# Altium project Smartwatch CPU Board.PrjPcb
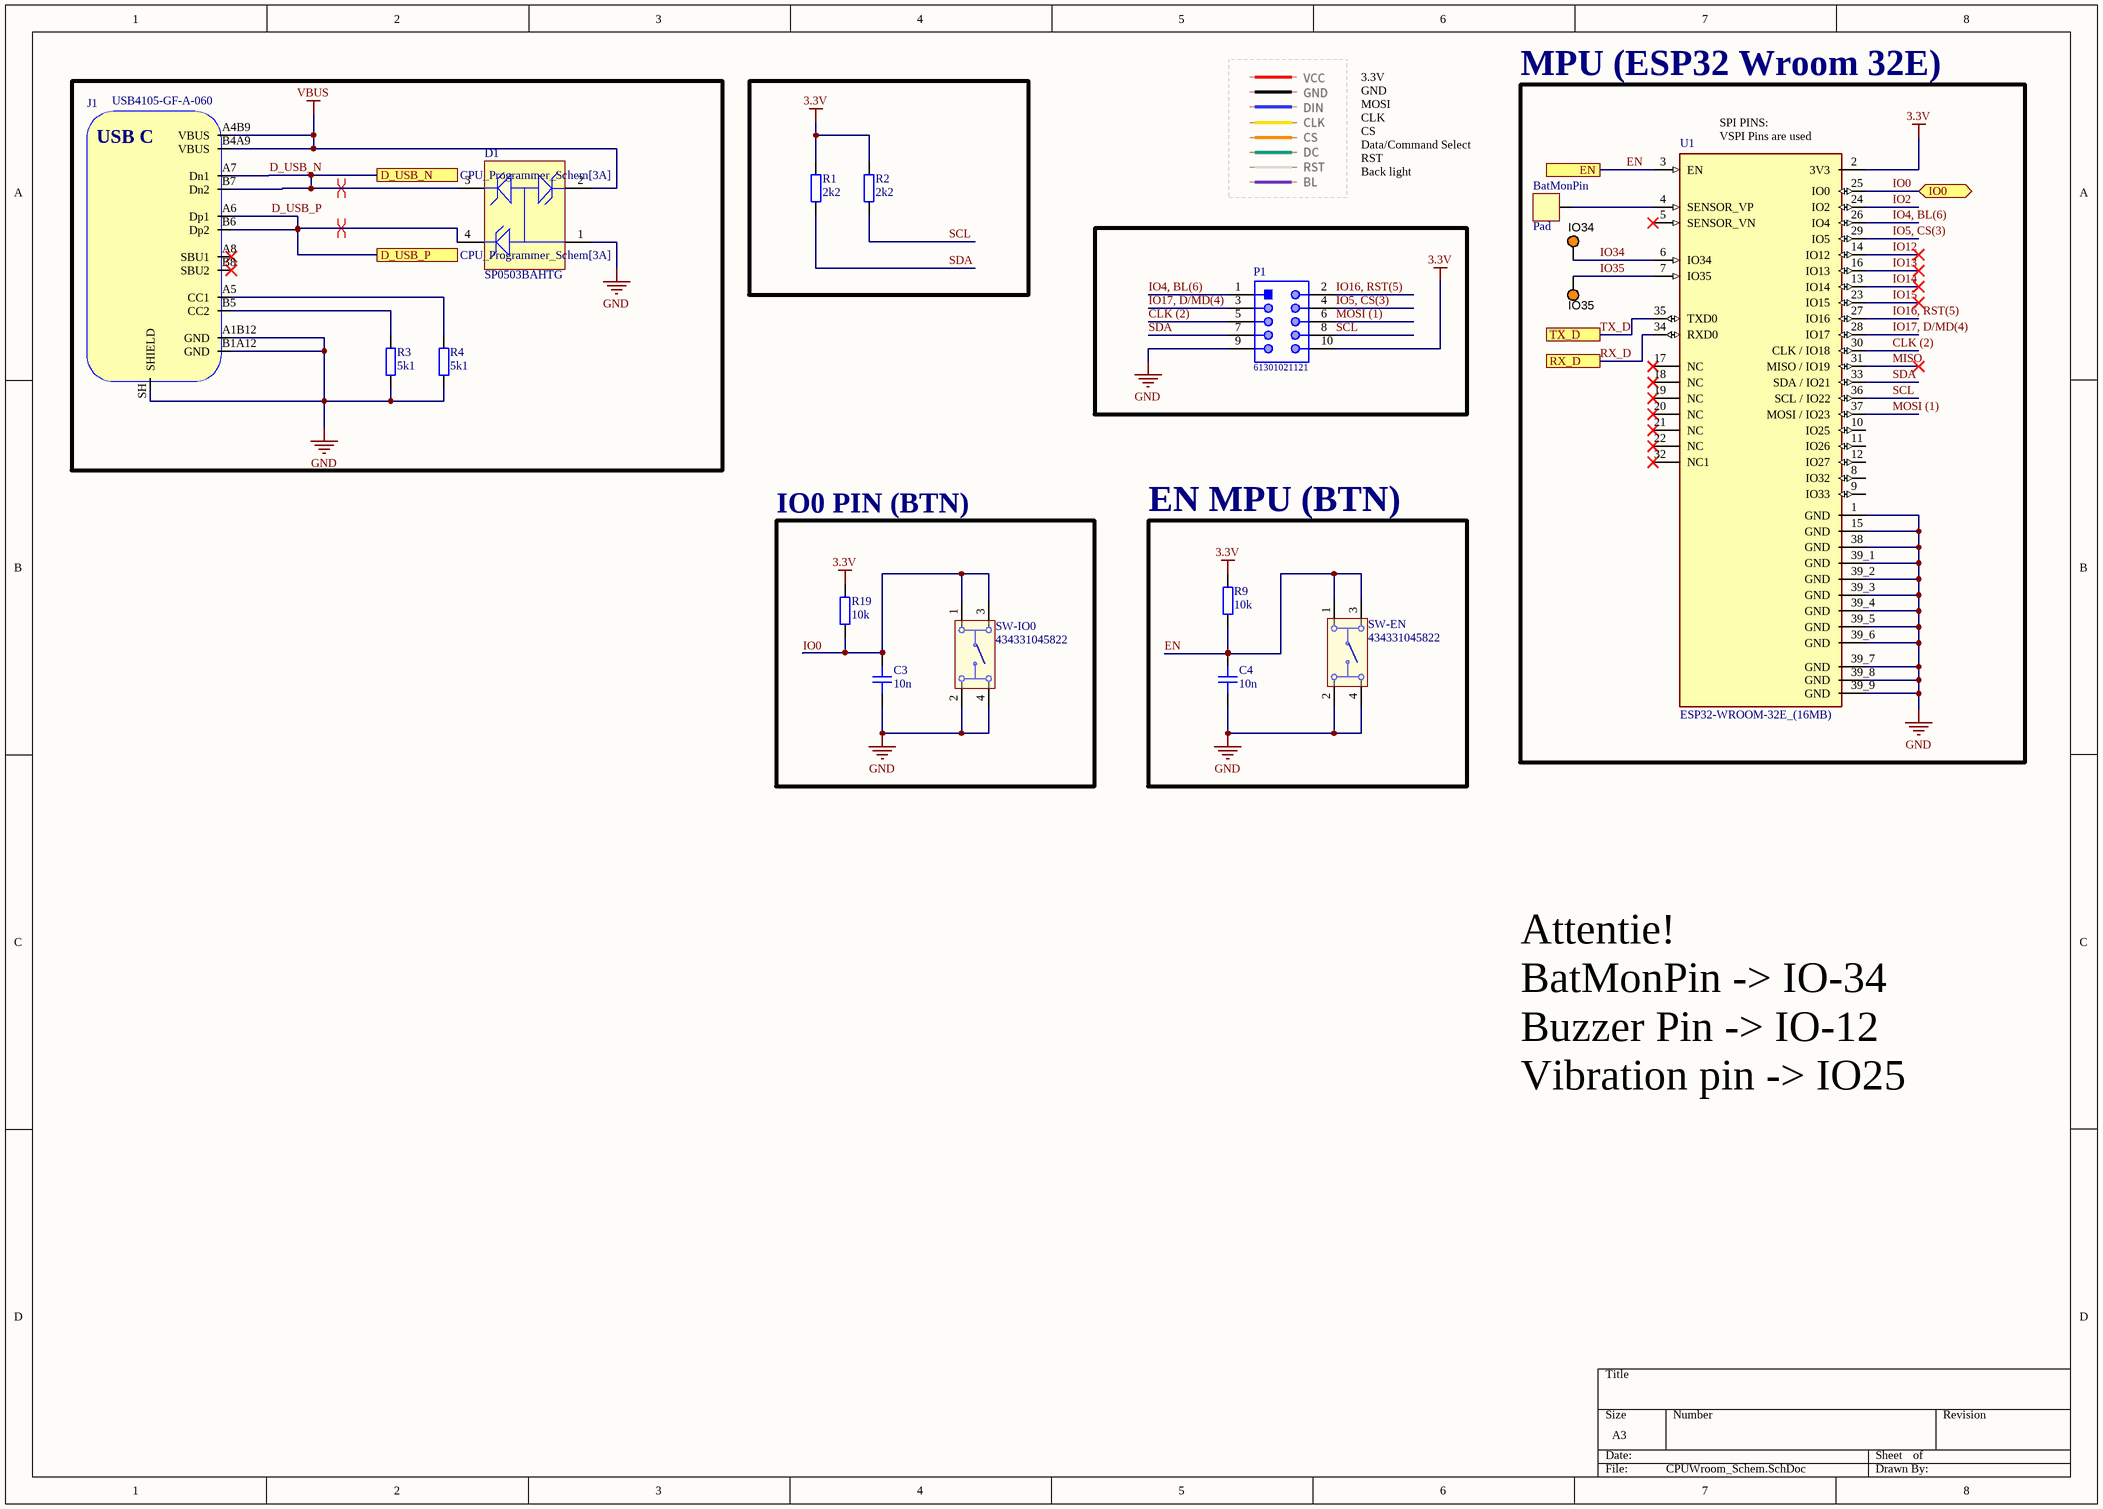
[diagram p0: CPUWroom_Schem.SchDoc]
2 sheets, 30 parts. Net scope: flat (ports and power ports of the same name join across sheets).
Board file: CPU_PCB.PcbDoc
Sheets:
  CPUWroom_Schem.SchDoc
  CPU_Programmer_Schem.SchDoc

## Sheet CPUWroom_Schem.SchDoc
size A3; SheetNumber: 1; SheetTotal: 2

### Parts
BatMonPin  Pad  [PAD_SQ_2MM]
C3  10n  [CAP_1206]
C4  10n  [CAP_1206]
D1  SP0503BAHTG  [LFUS-SOT143-4_V]
IO34  5003  [KSTN-5003]  (value not drawn)
IO35  5003  [KSTN-5003]  (value not drawn)
J1  USB4105-GF-A-060  [USB4105-GF-A-060]
P1  61301021121  [61301021121]
R1  2k2  [RES_1206]
R2  2k2  [RES_1206]
R3  5k1  [RES_1206]
R4  5k1  [RES_1206]
R9  10k  [RES_1206]
R19  10k  [RES_1206]
SW-EN  434331045822  [434331045822]
SW-IO0  434331045822  [434331045822]
U1  ESP32-WROOM-32E_(16MB)  [XCVR_ESP32-WROOM-32E_(16MB)]

### Blocks framed on the sheet
MPU (ESP32 Wroom 32E): BatMonPin IO34 IO35 U1
IO0 PIN (BTN): C3 R19 SW-IO0
EN MPU (BTN): C4 R9 SW-EN

### Ports
D_USB_N (see CPU_Programmer_Schem[3A]), D_USB_P (see CPU_Programmer_Schem[3A]), EN (see CPU_Programmer_Schem[6B]), IO0 (bidir, see CPU_Programmer_Schem[6A]), RX_D (see CPU_Programmer_Schem[1A], CPU_Programmer_Schem[4A]), TX_D (see CPU_Programmer_Schem[1A], CPU_Programmer_Schem[4A])

### Nets
3.3V: P1.10 R1.1 R2.1 R9.1 R19.1 U1.2(3V3)
GND: C3.1 C4.1 D1.1 J1.A1B12(GND) J1.B1A12(GND) J1.SH(SHIELD) P1.9 R3.1 R4.1 SW-EN.2 SW-EN.4 SW-IO0.2 SW-IO0.4 U1.1(GND) U1.15(GND) U1.38(GND) U1.39_1(GND) U1.39_2(GND) U1.39_3(GND) U1.39_4(GND) U1.39_5(GND) U1.39_6(GND) U1.39_7(GND) U1.39_8(GND) U1.39_9(GND)
VBUS: D1.2 J1.A4B9(VBUS) J1.B4A9(VBUS)
CLK (2): P1.5 U1.30(CLK_/_IO18)
D_USB_N: D1.3 J1.A7(Dn1) J1.B7(Dn2) ; port D_USB_N
D_USB_P: D1.4 J1.A6(Dp1) J1.B6(Dp2) ; port D_USB_P
EN: C4.2 R9.2 SW-EN.1 SW-EN.3 U1.3(EN) ; port EN
IO0: C3.2 R19.2 SW-IO0.1 SW-IO0.3 U1.25(IO0) ; port IO0
IO2: U1.24(IO2)
IO4, BL(6): P1.1 U1.26(IO4)
IO5, CS(3): P1.4 U1.29(IO5)
IO12: U1.14(IO12)
IO13: U1.16(IO13)
IO14: U1.13(IO14)
IO15: U1.23(IO15)
IO16, RST(5): P1.2 U1.27(IO16)
IO17, D/MD(4): P1.3 U1.28(IO17)
IO34: IO34.1 U1.6(IO34)
IO35: IO35.1 U1.7(IO35)
MISO: U1.31(MISO_/_IO19)
MOSI (1): P1.6 U1.37(MOSI_/_IO23)
RX_D: U1.34(RXD0) ; port RX_D
SCL: P1.8 R2.2 U1.36(SCL_/_IO22)
SDA: P1.7 R1.2 U1.33(SDA_/_IO21)
TX_D: U1.35(TXD0) ; port TX_D
NetBatMonPin_1: BatMonPin.1 U1.4(SENSOR_VP)
NetJ1_A5: J1.A5(CC1) R4.2
NetJ1_B5: J1.B5(CC2) R3.2

Not connected (* = marked no-connect by the designer): J1 A8(SBU1)* B8(SBU2)*; U1 5(SENSOR_VN)* 8(IO32) 9(IO33) 10(IO25) 11(IO26) 12(IO27) 17(NC)* 18(NC)* 19(NC)* 20(NC)* 21(NC)* 22(NC)* 32(NC1)*

### Layout directives
differential pair: D_USB_N, D_USB_P

### Notes on the sheet
- (near U1) SPI PINS:
  VSPI Pins are used
- 3.3V
  GND
  MOSI
  CLK
  CS
  Data/Command Select
  RST
  Back light
- Attentie!
  BatMonPin -> IO-34
  Buzzer Pin -> IO-12
  Vibration pin -> IO25
- (in symbol USB4105-GF-A-060) USB C

### Library data of the parts
BatMonPin = PAD_SQ_2MM: Test Point Square 2mm
C3 C4 = CAP_1206_50V: Capacitor SMD 1206 50V
D1 = CMP-2000-05191-1: TVS Diode Array, 30 pF, 30 KV, -40 to 85 degC, 4-Pin SOT143, RoHS, Tape and Reel; Manufacturer: Littelfuse; Direction Type: Uni-Directional; Product Height (mm): 1.05mm; Leakage Current (Max): 0.1uA; Clamping Voltage (Max): 8V; Reverse Stand-off Voltage: 5.5(Min)V; Configuration: Triple; Working Voltage: 5.5V; Product Length (mm): 3.04mm; Working Voltage (Max): 5.5V(Min); Capacitance Value: 30pF; Rad Hardened: No; Number of Elements: 3; Product Depth (mm): 1.4mm; Operating Temperature Max Deg. C: 85C; Suppressor Type: TVS; Operating Temperature Min Deg. C: -40C; Operating Temp Range: -40Cto85C; Mounting: SurfaceMount; Package / Case: SOT-143; Datasheet Version: Dec-13; Package Type: SOT-143; Packaging: TapeandReel; Pin Count: 3+Tab; Operating Temperature Classification: Industrial; Datasheet URL: https://datasheet.ciiva.com/15143/getdatasheetpartid-116020-15143550.pdf; Manufacturer URL: http://www.littelfuse.com/; Leakage Current: 0.1uA; Mounting Style: SurfaceMount; Clamping Voltage: 8V; Polarity: Uni-Directional
IO34 IO35 = CMP-002-00037-2: Test Point, Orange, Height 4.6 mm, Tail Length 3 mm, 1-Pin THD, RoHS; Manufacturer: Keystone; Colour: Orange; Packaging: Bulk; Package Description: 1-Pin Through Hole Device, Dia 2.54 mm; Pins: 1; Package Reference: 5003; Datasheet Version: Jun-15; Case/Package: 5003; Mounting Technology: TH; Connector Type: TestPoint; Diameter: 2.54mm; Contact Material: Bronze; Datasheet URL: http://keyelco.com/userAssets/file/M65p56.pdf; Manufacturer URL: http://www.keyelco.com/; Package Quantity: 10; Contact Plating: Tin; RoHS Compliant: True
J1 = USB4105-GF-A-060: USB Connector Type C SMT 12 Pin; Manufacturer: GCT; Manufacturer Part Number: USB4105-GF-A-060
P1 = CMP-1502-01084-1: THT Vertical Pin Header WR-PHD, Pitch 2.54 mm, Dual Row, 10 pins; Manufacturer: Wurth Elektronik; Working Voltage: 250VAC; Pitch: 2.54mm; Contact Resistance: 20mOhm; Gender: Male; Rated Current: 3A; Withstanding Voltage: 500VAC; Pin Number: 10; Operating Temperature: -40to105degC; Mounting Technology: THT; Publisher: WurthElektronik; Manufacturer URL: http://www.we-online.de; Part Number: 61301021121; Row Number: Dual; Packaging: Bag; Orientation: Vertical; Package Reference: 61301021121; Datasheet URL: https://katalog.we-online.de/em/datasheet/6130xx21121.pdf
R1-R4 R9 R19 = RES_1206: Resistor SMD 1206
SW-EN SW-IO0 = CMP-1461-00001-1: WS-TASU SMD Tact Switch 4.7X3.5 mm side push; Manufacturer: Wuerth Elektronik; NoPins: 04; ComponentLink1Description: Manufacturer URL; ComponentLink2Description: Datasheet; PartNumber: 434331045822; PackageReference: 434331045822; ComponentLink2URL: http://katalog.we-online.de/em/datasheet/434331045822.pdf; ComponentLink1URL: http://www.we-online.com
U1 = ESP32-WROOM-32E_(16MB): Bluetooth, WiFi 802.11b/g/n, Bluetooth v4.2 +EDR, Class 1, 2 and 3 Transceiver Module 2.4GHz ~ 2.5GHz Integrated, Trace Surface Mount; MP: ESP32-WROOM-32E (16MB); MF: Espressif Systems; Price: None; Availability: Not in stock; Package: None; Value: *; SnapEDA_Link: https://www.snapeda.com/parts/ESP32-WROOM-32E%20(16MB)/Espressif+Systems/view-part/?ref=snap; Check_prices: https://www.snapeda.com/parts/ESP32-WROOM-32E%20(16MB)/Espressif+Systems/view-part/?ref=eda

## Sheet CPU_Programmer_Schem.SchDoc
size A3; SheetNumber: 2; SheetTotal: 2
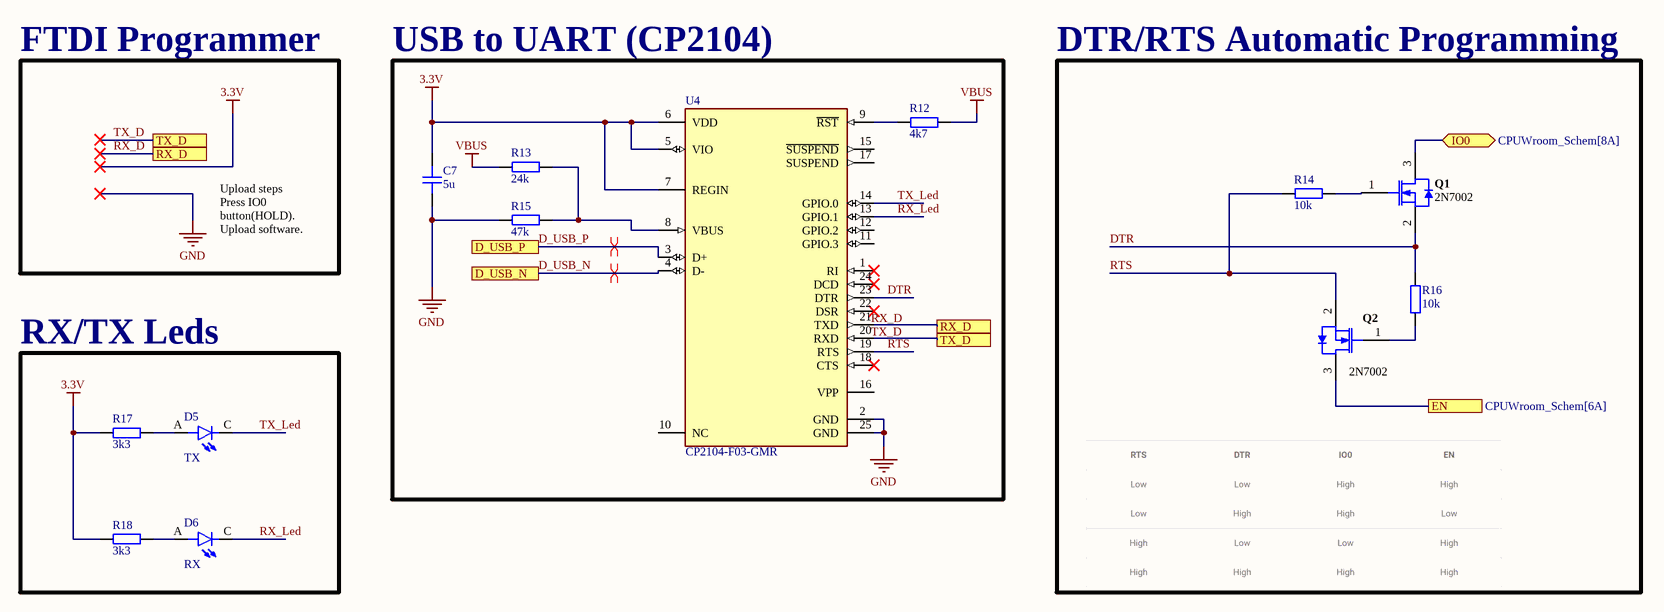
[diagram p1: CPU_Programmer_Schem.SchDoc]

### Parts
C7  5u  [CAP_1206]
D5  TX  [LED_1206]
D6  RX  [LED_1206]
Q1  2N7002  [INF-PG-SOT23_M]
Q2  2N7002  [INF-PG-SOT23_M]
R12  4k7  [RES_1206]
R13  24k  [RES_1206]
R14  10k  [RES_1206]
R15  47k  [RES_1206]
R16  10k  [RES_1206]
R17  3k3  [RES_1206]
R18  3k3  [RES_1206]
U4  CP2104-F03-GMR  [FP-CP2104-F03-GMR-MFG]

### Blocks framed on the sheet
USB to UART (CP2104): C7 R12 R13 R15 U4
DTR/RTS Automatic Programming: Q1 Q2 R14 R16
RX/TX Leds: D5 D6 R17 R18

### Ports
D_USB_N (see CPUWroom_Schem[2A]), D_USB_P (see CPUWroom_Schem[2A]), EN (see CPUWroom_Schem[6A]), IO0 (bidir, see CPUWroom_Schem[8A]), RX_D (see CPU_Programmer_Schem[1A], CPUWroom_Schem[6A]), RX_D (see CPU_Programmer_Schem[4A], CPUWroom_Schem[6A]), TX_D (see CPU_Programmer_Schem[1A], CPUWroom_Schem[6A]), TX_D (see CPU_Programmer_Schem[4A], CPUWroom_Schem[6A])

### Nets
3.3V: C7.2 R17.1 R18.1 U4.5(VIO) U4.6(VDD) U4.7(REGIN)
GND: C7.1 R15.1 U4.2(GND) U4.25(GND)
VBUS: R12.1 R13.1
D_USB_N: U4.4(D-) ; port D_USB_N
D_USB_P: U4.3(D+) ; port D_USB_P
DTR: Q1.2(SOURCE) R16.1 U4.23(DTR)
EN: Q2.3(DRAIN) ; port EN
IO0: Q1.3(DRAIN) ; port IO0
RTS: Q2.2(SOURCE) R14.1 U4.19(RTS)
RX_D: U4.21(TXD) ; port RX_D
RX_Led: D6.C U4.13(GPIO.1)
TX_D: U4.20(RXD) ; port TX_D
TX_Led: D5.C U4.14(GPIO.0)
NetD5_A: D5.A R17.2
NetD6_A: D6.A R18.2
NetQ1_1: Q1.1(GATE) R14.2
NetQ2_1: Q2.1(GATE) R16.2
NetR12_2: R12.2 U4.9(~{RST})
NetR13_2: R13.2 R15.2 U4.8(VBUS)

Not connected (* = marked no-connect by the designer): U4 1(RI)* 10(NC) 11(GPIO.3) 12(GPIO.2) 15(~{SUSPEND}) 16(VPP) 17(SUSPEND) 18(CTS)* 22(DSR)* 24(DCD)*

### Layout directives
differential pair: D_USB_N, D_USB_P

### Notes on the sheet
- FTDI Programmer
- Upload steps
  Press IO0 button(HOLD).
  Upload software.
- Labels drawn without touching a wire or pin: RX_D, TX_D

### Library data of the parts
C7 = CAP_1206_50V: Capacitor SMD 1206 50V
D5 D6 = LED - 1206: Yellow 587nm LED Indication - Discrete 2V 1206 _3216 Metric_; MF: Lite-On Inc.; MP: LTST-C230KSKT; Value: *; SnapEDA_Link: https://www.snapeda.com/parts/LTST-C230KSKT/Lite-On%20Inc./view-part/264912/?ref=snap; Availability: Unavailable; Package: 1206 Lite-On; Price: None
Q1 Q2 = CMP-1149-00026-1: N-Channel OptiMOS Small-Signal-Transistor, 60 V VDS, 0.3 A ID, -55 to 150 degC, PG-SOT23, Reel, Green; Manufacturer: Infineon; RDS (on) (max) (@4.5V): 4,000 mOhm; VDS (max): 60 V; IDpuls (max): 1.2Â A; QG: 0.4Â nC; RDS (on) (max): 3,000 mOhm; RthJA (max): 250 K/W; ID (max): 0.3Â A; VGS(th) (max): 2.5Â V; VGS(th) (min): 1.5Â V; Green: TRUE; Ptot (max): 0.5Â W; PackageDescription: 3-Pin Small Outline Transistor Package, 2.9 x 1.3 mm Body, 0.95 mm Pitch; Halogen-free: TRUE; ComponentLink2Description: Datasheet; ComponentLink1URL: http://www.infineon.com/; Packing: Reel; DatasheetVersion: Rev. 2.4; PartNumber: 2N7002; PackageReference: PG-SOT23; PackageVersion: Apr-08; ComponentLink3URL: http://www.infineon.com/dgdl/SOT23-Package_Overview.pdf?folderId=db3a30431936bc4b0119532290053c66&fileId=db3a30431936bc4b0119533468123c85; ComponentLink1Description: Manufacturer URL; Mounting Technology: Surface Mount; ComponentLink3Description: Package Specification; ComponentLink2URL: http://www.infineon.com/dgdl/2N7002_Rev2.4.pdf?folderId=db3a3043156fd573011622e10b5c1f67&fileId=db3a304319bc939a0119c2a9461e79e6
R12-R18 = RES_1206: Resistor SMD 1206
U4 = CMP-08107-000004-1: IC SGL USB-TO-UART BRIDGE 24QFN; Manufacturer: Silicon Laboratories; Max Supply Voltage: 3.6V; Min Supply Voltage: 1.8V; Nominal Supply Current: 100-17000uA; Standoff Height: 0mm; Interface: UART,USB; Temperature Range Low: -40°C; Lead Free: Yes; Device Class L3: Controllers; Ambient Temperature Range Low: -55°C; Automotive: No; Category: IC; Temperature: -40°C to +85°C; Octopart: https://octopart.com/cp2104-f03-gmr-silicon+labs-19668642; Ambient Temperature Range High: +125°C; Package: CP2104-F03-GMR; Device Class L2: Interface ICs; Digikey Description: IC SGL USB-TO-UART BRIDGE 24QFN; Device Class L1: Integrated Circuits (ICs); Manufacturer Part Number: CP2104-F03-GMR; Temperature Range High: +85°C; ComponentLink2URL: https://www.silabs.com/documents/public/data-sheets/cp2104.pdf; Height: 0.8mm; Ipc Land Pattern Name: QFN50P400X400X75-24; Mouser Description: I/O Controller Interface IC USB to UART bridge; ComponentLink2Description: Datasheet; RoHS: TRUE

## Nets that join several sheets
3.3V: CPUWroom_Schem (6 pins), CPU_Programmer_Schem (6 pins)
GND: CPUWroom_Schem (25 pins), CPU_Programmer_Schem (C7.1 R15.1 U4.2 U4.25)
VBUS: CPUWroom_Schem (D1.2 J1.A4B9 J1.B4A9), CPU_Programmer_Schem (R12.1 R13.1)
D_USB_N: CPUWroom_Schem (D1.3 J1.A7 J1.B7), CPU_Programmer_Schem (U4.4)
D_USB_P: CPUWroom_Schem (D1.4 J1.A6 J1.B6), CPU_Programmer_Schem (U4.3)
EN: CPUWroom_Schem (5 pins), CPU_Programmer_Schem (Q2.3)
IO0: CPUWroom_Schem (5 pins), CPU_Programmer_Schem (Q1.3)
RX_D: CPUWroom_Schem (U1.34), CPU_Programmer_Schem (U4.21)
TX_D: CPUWroom_Schem (U1.35), CPU_Programmer_Schem (U4.20)